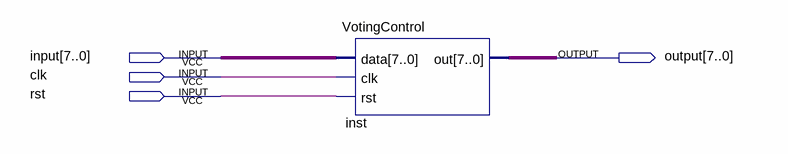
[diagram p0: schematic sheet]
// Quartus schematic VotingMachine.bdf as structural Verilog: 1 symbols, 4 pins
module VotingMachine (
  input  [7:0] \input ,
  input  clk,
  input  rst,
  output [7:0] \output 
);

  VotingControl inst (.data(\input ), .clk(clk), .rst(rst), .out(\output ));
endmodule
